# Altium schematic sheet CHC_Accumulator.SchDoc
size A4
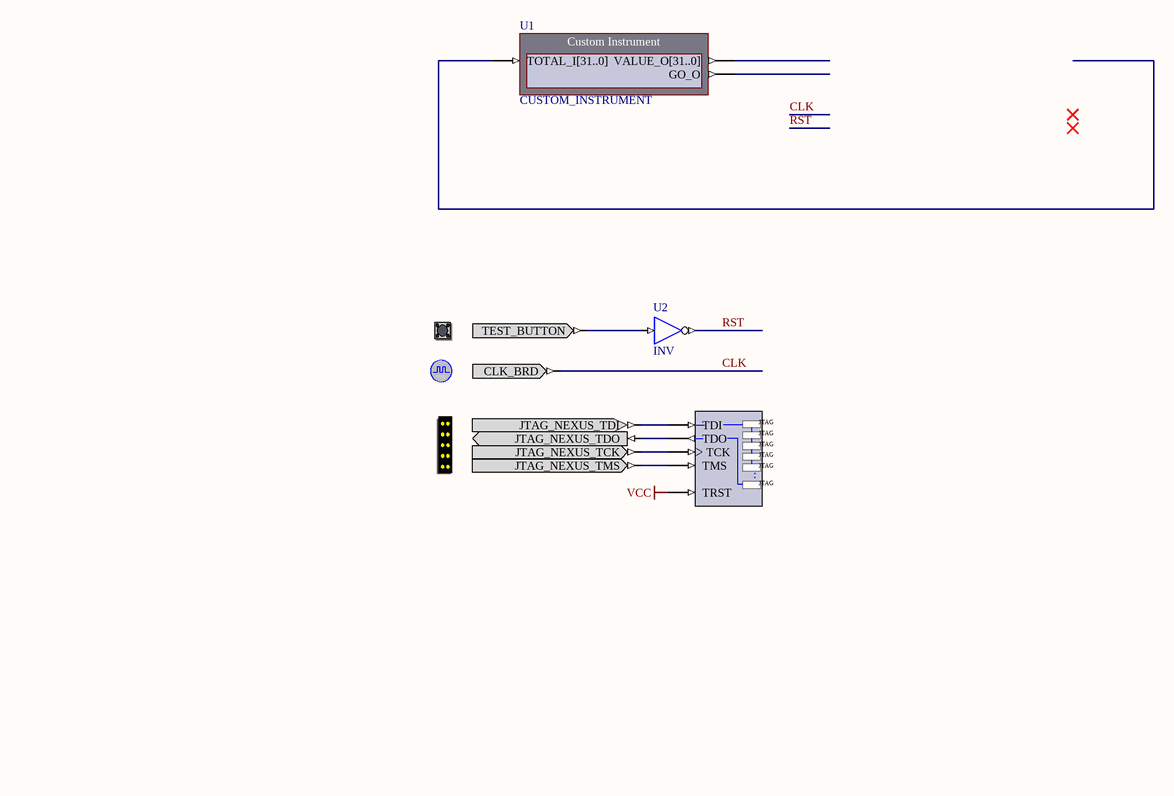
[diagram p0: CHC_Accumulator.SchDoc]

## Parts
(Parts that share a designator on the sheet are numbered #1, #2 ... from top to bottom, then left to right.)
?#1  TEST_BUTTON  (value not drawn)
?#2  CLOCK_BOARD  (value not drawn)
?#3  NEXUS_JTAG_CONNECTOR  (value not drawn)
NEXUS_JTAG_PORT  NEXUS_JTAG_PORT  (value not drawn)
U1  CUSTOM_INSTRUMENT
U2  INV

## Nets
VCC: NEXUS_JTAG_PORT.TRST
CLK: ?#2.CLK_BRD
RST: U2.O
Net?#1_TEST_BUTTON: ?#1.TEST_BUTTON U2.I
Net?#3_JTAG_NEXUS_TCK: ?#3.JTAG_NEXUS_TCK NEXUS_JTAG_PORT.TCK
Net?#3_JTAG_NEXUS_TDI: ?#3.JTAG_NEXUS_TDI NEXUS_JTAG_PORT.TDI
Net?#3_JTAG_NEXUS_TDO: ?#3.JTAG_NEXUS_TDO NEXUS_JTAG_PORT.TDO
Net?#3_JTAG_NEXUS_TMS: ?#3.JTAG_NEXUS_TMS NEXUS_JTAG_PORT.TMS

Not connected (* = marked no-connect by the designer): U1 GO_O TOTAL_I[31..0] VALUE_O[31..0]

## Notes on the sheet
- (in symbol NEXUS_JTAG_PORT) .

## Library data of the parts
?#1 = TEST_BUTTON: Test / Reset Button; PortComponent: True; Published: 19-Nov-2003; Publisher: Altium Limited; HelpURL: TR0143 Technical Reference Manual for Altium's Desktop NanoBoard NB2DSK01.pdf#page=53
?#2 = CLOCK_BOARD: Global System Clock Supply; PortComponent: True; Published: 19-Nov-2003; Publisher: Altium Limited; HelpURL: TR0143 Technical Reference Manual for Altium's Desktop NanoBoard NB2DSK01.pdf#page=41; UseInDSF: True
?#3 = NEXUS_JTAG_CONNECTOR: JTAG Port; PortComponent: True; Published: 19-Nov-2003; Publisher: Altium Limited; HelpURL: TR0102 NanoBoard Technical Reference Manual - NB1.pdf#page=33
NEXUS_JTAG_PORT = NEXUS_JTAG_PORT: Soft Nexus-Chain Connector; NEXUS_JTAG_CONNECTOR: True; FunctionalClass: JTAG; Published: 29-Jan-2004; Publisher: Altium Limited; LastRevisionNo: 1.00.00; HelpURL: CR0118 FPGA Generic Library Guide.pdf#page=405
U1 = CUSTOM_INSTRUMENT: Custom Instrument; NEXUS_JTAG_DEVICE: True; NEXUS_JTAG_ORDER: 0; ConfigurationParameters: {}Version[1.0]{}Storage[CHC_Accumulator U1.Instrument]{}StorageType[0]{}RackTitle[Custom Instrument]{}ShowOptionsButton[True]{}ShowSyncButton[True]{}SchCompWidth[140]{}CustomPanelViewer[False]{}InterfaceType[Parallel]{}ID[0]{}AutoShow[True]{}DisabledInDashboard[False]{}Input0Name[TOTAL_I{1}31..0{2}]{}Input0Width[32]{}Input0InitValue[0]{}Output0Name[VALUE_O{1}31..0{2}]{}Output0Width[32]{}Output0InitValue[0]{}Output1Name[GO_O]{}Output1Width[1]{}Output1InitValue[0]{}UseBitmap[False]{}Code_Len[236]{}Code_Data[78DAA5903F4FC33010C5F748F90EB73559A2766D952129103140AAD62AA375C48F60701DE4D803DF1E97B2A022B5A537DD1FDD7B7ABF2DBB34A1586DF01FC13F39ED3D2CCDA91E0603B68B344993951B3AA8E040E206A3EE2D54E5C02BB630451DBC1FACAC94924BA3BBF76C03ABE0A284689FDFD0F93C6AD4E8B53D18DDBFD0264AB07960CB3D5CD1C01F16F5E723EF904D9A56B693BCD8B209A092A6245EF1F3BCAF4BBEE725CD167F062CE98ECD8878BCB5EA74CAA38D5C83D55E0DA7021F190B17CEF6157A07279B618D115E7E4F6700FE6D595945D965CC67F975D0A7FFE7BA8CDDF550BF00B63AE7BB]{}Design_Len[722]{}Design_Data[78DAED565B6FDA30187D9FB4FF90379E864808D04EDA43B8B5486C549096870A456E6CC0AB6333C7E9BA7F3F5F92900B948E6E7B98F682E4731CBECFE7F87C097BF88A42610D518C3714418F23700328221F2DBF86BD7F67594B0CC5D6FA64755D572DAF11DE6C855CDBAEA3D663464573B0053C460A1D8EC6DEEDD40F06D7DE7C31F2F73B18615CF22159620AD9771F3D8B9CCCFFF3836DE7E017102109357CB0651168E4F842FC208AB85F29684607B259A1805AF781A1CCB6390270C9F1919D39AB36B35421BCC1220E7C268012674263C1930851311D0D0DA7365BD614AD55EF8EDB326B9FEDE4B2D335AB4C3EBBE31A203FAC93EEF042819FD05E20EF5B020C9361AEED5C149045B8455A1B12C68324162C32A4694AD56A158109BDE22C513DB50D3CA1A052B24F40F868C8CF48701CC6CD11858B1D085519A7CC1C8305E0E208B73F734ACC760233AA7ABD873BA6FB33CDAE0C7F03B8143A6B700C488C0C3107103F4B88C3E7210A710488C117D25040F23B33F3BD6930B96FDBCD666BD5305BEE004914ABC5411416AC9E820779097C2C082A3BADF092CB76F7A2E8F245C5E4CB4EC5E476661CD02756CD79619844090182F146D9E79211A783558BD6FEE65462E5F40A702692C7312096AED828D079BED6F144DE7C1C9EB2C410EAD932EE7340E39D2625E1F3041D15BE1EB153C2772ACA779C6ABADC9AF0BACC5F93DC3E26F911B1FB8CC03F29753ACE740A7E7D9C5DFE1F672F8CB3378EAB3B6F7A3B0A66E571751BA3215A8384087DEE814CE263C1DC57CC3353E435E1725BA57075DDB2D9DD5EC56BBB7D385CE5139C11A7E5367D07D7F27479C6045BFDAE0165943C109D534ADAAD8A94BDD66929759D7F4FCA7E2204A3810761494303BF34EBABB327FBB4DAC7B0537FC942F806E94A9FA8F58FD4F6F9A35D7EAFA641DECB1168A82E988F23C4832B3647B275A9995E67334F20FE241DCB67D38C6A5AA95F7C2C283C94AADB3D78457569FDF313BF27658B]{}; NEXUS_CORE: Instrument; ConfiguratorName: CUSTOM_INSTRUMENT; ComponentLink1Description: Core &Resource Usage; ComponentLink1URL: CR0134 FPGA Instrument Resource Usage.pdf; Core Revision: 1.00.00; LastRevisionNo: 1.00.00; Published: 08-Apr-2008; Publisher: Altium Limited
U2 = INV: Inverter; FunctionalClass: Logic Primitive; ArchiveName: GENERIC; VHDLIB_SIM: GENERIC_LIB; Published: 29-Jan-2004; Publisher: Altium Limited; XilinxEquivalent: INV; LastRevisionNo: 1.00.00; HelpURL: CR0118 FPGA Generic Library Guide.pdf#page=291; ComponentLink1URL: CR0136 FPGA Logic Primitive Resource Usage.pdf#page=61; ComponentLink1Description: Core &Resource Usage; SubClass: INV